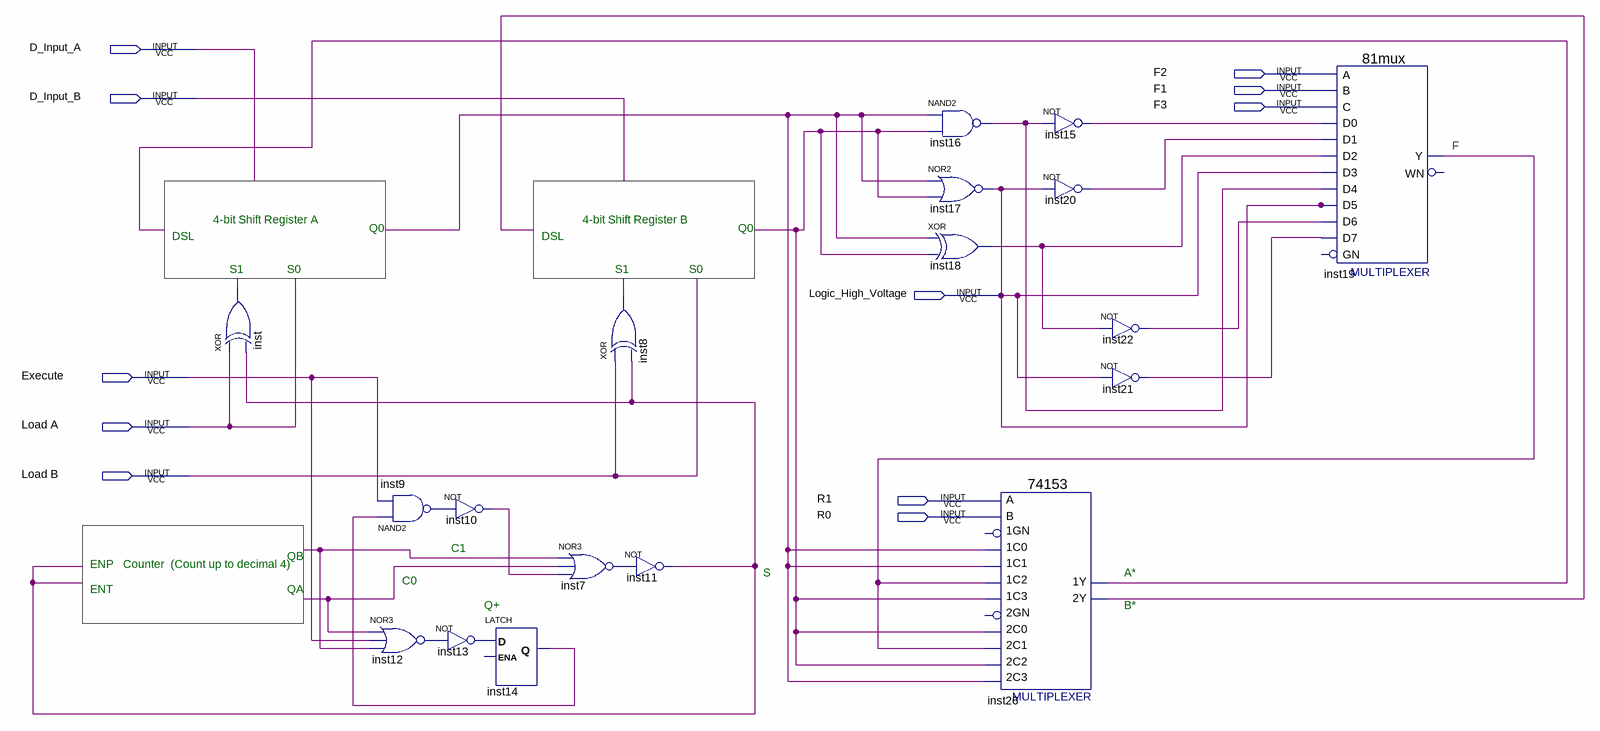
[diagram p0: schematic sheet]
// Quartus schematic SG_AS_Official.bdf as structural Verilog: 18 symbols, 11 pins
module SG_AS_Official (
  input  D_Input_A,
  input  F2,
  input  F1,
  input  D_Input_B,
  input  F3,
  input  Logic_High_Voltage,
  input  Execute,
  input  \Load_A ,
  input  \Load_B ,
  input  R1,
  input  R0
);

  wire inst7_out, inst8_out, inst9_out, inst10_out, inst11_out, inst12_out, inst13_out, inst14_q, inst15_out,
       inst16_out, inst18_out, inst19_y, inst20_out, inst21_out, inst22_out, inst26_1y, inst26_2y, inst_out,
       undriven, undriven_2, undriven_3, undriven_4;

  xor inst (inst_out, \Load_A , inst11_out);
  nand inst9 (inst9_out, inst14_q, Execute);
  nor inst12 (inst12_out, undriven, Execute, undriven_2);
  not inst10 (inst10_out, inst9_out);
  not inst13 (inst13_out, inst12_out);
  LATCH inst14 (.D(inst13_out), .Q(inst14_q));  // open: ENA
  nor inst7 (inst7_out, undriven_2, undriven, inst10_out);
  xor inst8 (inst8_out, \Load_B , inst11_out);
  not inst11 (inst11_out, inst7_out);
  nand inst16 (inst16_out, undriven_3, undriven_4);
  nor inst17 (Logic_High_Voltage, undriven_3, undriven_4);
  xor inst18 (inst18_out, undriven_3, undriven_4);
  \74153  inst26 (
    .\1C1 (undriven_3), .\1C0 (undriven_3), .\2C0 (undriven_4), .\2C2 (undriven_4), .\1C2 (inst19_y),
    .\1C3 (undriven_4), .B(R0), .A(R1), .\2C1 (inst19_y), .\2C3 (undriven_3), .\1Y (inst26_1y),
    .\2Y (inst26_2y));  // open: 1GN, 2GN
  not inst15 (inst15_out, inst16_out);
  not inst20 (inst20_out, Logic_High_Voltage);
  not inst22 (inst22_out, inst18_out);
  not inst21 (inst21_out, Logic_High_Voltage);
  \81mux  inst19 (
    .C(F3), .D1(inst20_out), .D0(inst15_out), .D5(Logic_High_Voltage), .D4(inst16_out), .D2(inst18_out),
    .D3(Logic_High_Voltage), .D7(inst21_out), .D6(inst22_out), .A(F2), .B(F1), .Y(inst19_y));  // open: GN, WN

  // Notes on the sheet:
  //   F
  //   4-bit Shift Register A
  //   4-bit Shift Register B
  //   Q0
  //   Q0
  //   DSL
  //   DSL
  //   S1
  //   S0
  //   S1
  //   S0
  //   C1
  //   QB
  //   ENP
  //   Counter  (Count up to decimal 4)
  //   S
  //   A*
  //   C0
  //   ENT
  //   QA
  //   Q+
  //   B*
endmodule
